# EAGLE design Rapide64a (EAGLE 6.3)
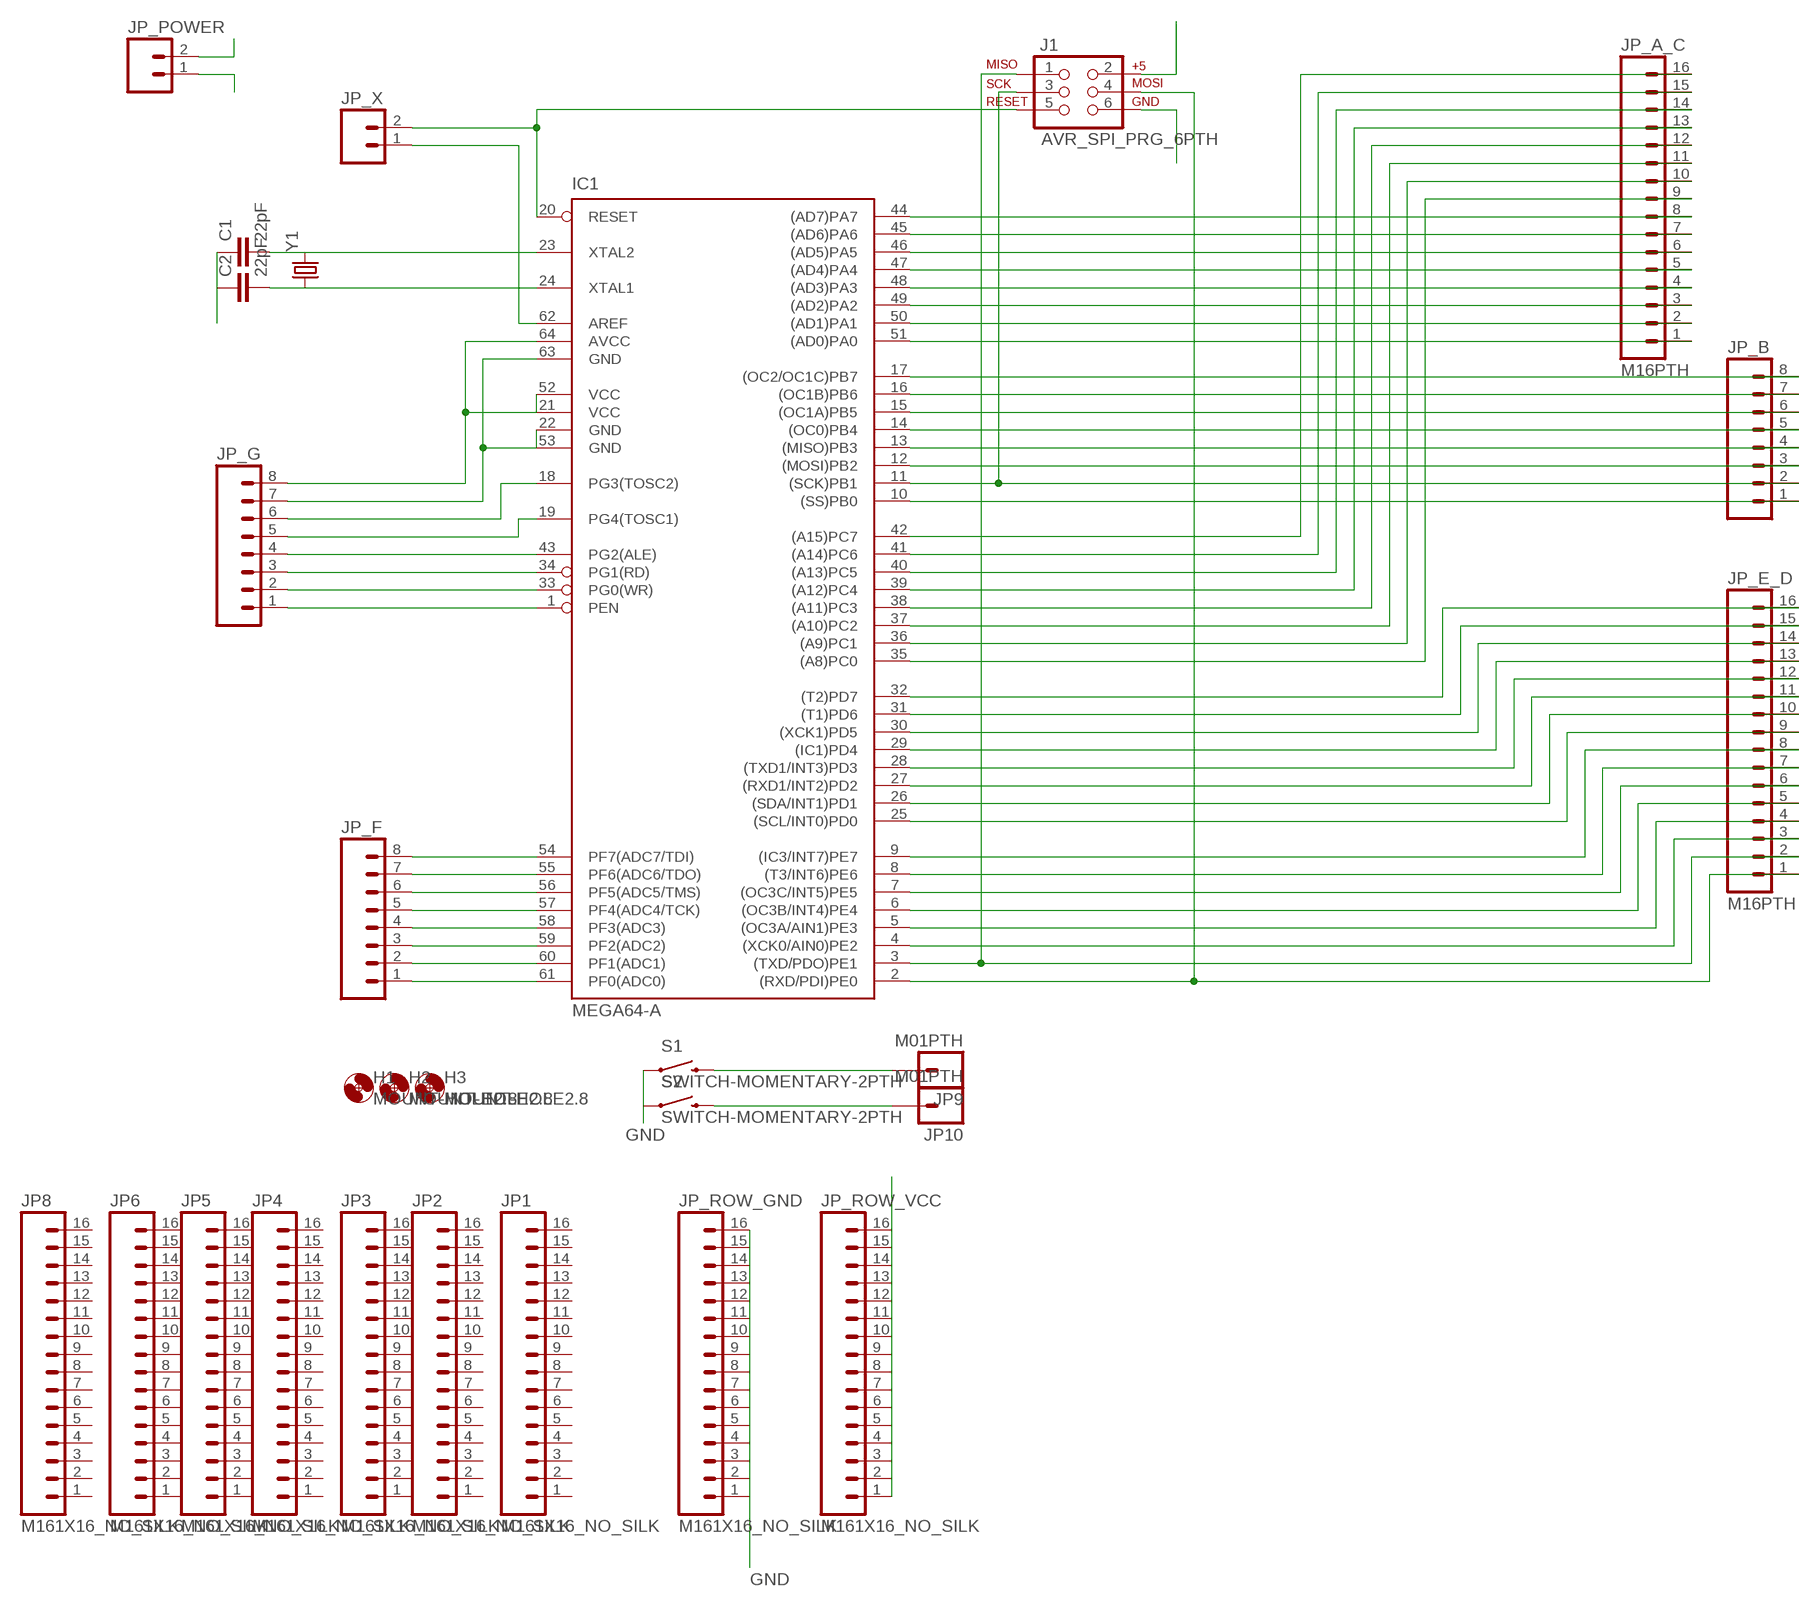
[diagram p0: schematic, sheet 1]

## Parts
C1  22pF  C-EU025-024X044  [C025-024X044]
C2  22pF  C-EU025-024X044  [C025-024X044]
H1  MOUNT-HOLE2.8  [2,8]
H2  MOUNT-HOLE2.8  [2,8]
H3  MOUNT-HOLE2.8  [2,8]
IC1  MEGA64-A  [TQFP64]
J1  AVR_SPI_PRG_6PTH  [2X3]
JP1  M161X16_NO_SILK  [1X16_NO_SILK]
JP2  M161X16_NO_SILK  [1X16_NO_SILK]
JP3  M161X16_NO_SILK  [1X16_NO_SILK]
JP4  M161X16_NO_SILK  [1X16_NO_SILK]
JP5  M161X16_NO_SILK  [1X16_NO_SILK]
JP6  M161X16_NO_SILK  [1X16_NO_SILK]
JP8  M161X16_NO_SILK  [1X16_NO_SILK]
JP9  M01PTH  [1X01]
JP10  M01PTH  [1X01]
JP_A_C  M16PTH  [1X16]
JP_B  M081X08  [1X08]
JP_E_D  M16PTH  [1X16]
JP_F  M081X08  [1X08]
JP_G  M081X08  [1X08]
JP_POWER  M02PTH  [1X02]
JP_ROW_GND  M161X16_NO_SILK  [1X16_NO_SILK]
JP_ROW_VCC  M161X16_NO_SILK  [1X16_NO_SILK]
JP_X  M02PTH  [1X02]
S1  SWITCH-MOMENTARY-2PTH  [TACTILE-PTH]
S2  SWITCH-MOMENTARY-2PTH  [TACTILE-PTH]
Y1  CRYSTALHC49UV  [HC49U-V]

## Nets
GND: C1.1 C2.1 IC1.22(GND) IC1.53(GND) IC1.63(GND) J1.6 JP_G.7 JP_POWER.1 JP_ROW_GND.1 JP_ROW_GND.2 JP_ROW_GND.3 JP_ROW_GND.4 JP_ROW_GND.5 JP_ROW_GND.6 JP_ROW_GND.7 JP_ROW_GND.8 JP_ROW_GND.9 JP_ROW_GND.10 JP_ROW_GND.11 JP_ROW_GND.12 JP_ROW_GND.13 JP_ROW_GND.14 JP_ROW_GND.15 JP_ROW_GND.16 S1.1 S2.1
MISO: IC1.3((TXD/PDO)PE1) J1.1 JP_E_D.2
MOSI: IC1.2((RXD/PDI)PE0) J1.4 JP_E_D.1
N$2: IC1.6((OC3B/INT4)PE4) JP_E_D.5
N$3: IC1.7((OC3C/INT5)PE5) JP_E_D.6
N$4: IC1.8((T3/INT6)PE6) JP_E_D.7
N$5: IC1.25((SCL/INT0)PD0) JP_E_D.9
N$6: IC1.9((IC3/INT7)PE7) JP_E_D.8
N$7: IC1.26((SDA/INT1)PD1) JP_E_D.10
N$8: IC1.27((RXD1/INT2)PD2) JP_E_D.11
N$9: IC1.58(PF3(ADC3)) JP_F.4
N$10: IC1.57(PF4(ADC4/TCK)) JP_F.5
N$11: IC1.56(PF5(ADC5/TMS)) JP_F.6
N$12: IC1.55(PF6(ADC6/TDO)) JP_F.7
N$13: IC1.54(PF7(ADC7/TDI)) JP_F.8
N$14: IC1.48((AD3)PA3) JP_A_C.4
N$16: IC1.10((SS)PB0) JP_B.1
N$17: IC1.49((AD2)PA2) JP_A_C.3
N$18: IC1.17((OC2/OC1C)PB7) JP_B.8
N$19: IC1.1(PEN) JP_G.1
N$20: IC1.33(PG0(WR)) JP_G.2
N$21: IC1.34(PG1(RD)) JP_G.3
N$22: IC1.18(PG3(TOSC2)) JP_G.6
N$23: IC1.19(PG4(TOSC1)) JP_G.5
N$24: IC1.39((A12)PC4) JP_A_C.13
N$35: IC1.12((MOSI)PB2) JP_B.3
N$36: IC1.13((MISO)PB3) JP_B.4
N$37: IC1.43(PG2(ALE)) JP_G.4
N$38: IC1.47((AD4)PA4) JP_A_C.5
N$39: IC1.46((AD5)PA5) JP_A_C.6
N$40: IC1.45((AD6)PA6) JP_A_C.7
N$41: JP9.1 S1.3
N$42: IC1.14((OC0)PB4) JP_B.5
N$43: IC1.51((AD0)PA0) JP_A_C.1
N$44: IC1.50((AD1)PA1) JP_A_C.2
N$45: IC1.15((OC1A)PB5) JP_B.6
N$46: JP10.1 S2.3
N$47: IC1.44((AD7)PA7) JP_A_C.8
N$48: IC1.16((OC1B)PB6) JP_B.7
N$49: IC1.42((A15)PC7) JP_A_C.16
N$50: IC1.41((A14)PC6) JP_A_C.15
N$51: IC1.40((A13)PC5) JP_A_C.14
N$56: IC1.35((A8)PC0) JP_A_C.9
N$58: IC1.62(AREF) JP_X.1
N$59: C1.2 IC1.23(XTAL2) Y1.2
N$60: C2.2 IC1.24(XTAL1) Y1.1
N$62: IC1.4((XCK0/AIN0)PE2) JP_E_D.3
N$63: IC1.5((OC3A/AIN1)PE3) JP_E_D.4
N$64: IC1.28((TXD1/INT3)PD3) JP_E_D.12
N$65: IC1.29((IC1)PD4) JP_E_D.13
N$66: IC1.30((XCK1)PD5) JP_E_D.14
N$67: IC1.31((T1)PD6) JP_E_D.15
N$68: IC1.32((T2)PD7) JP_E_D.16
N$69: IC1.38((A11)PC3) JP_A_C.12
N$70: IC1.61(PF0(ADC0)) JP_F.1
N$71: IC1.60(PF1(ADC1)) JP_F.2
N$72: IC1.59(PF2(ADC2)) JP_F.3
N$73: IC1.37((A10)PC2) JP_A_C.11
N$75: IC1.36((A9)PC1) JP_A_C.10
RESET: IC1.20(RESET) J1.5 JP_X.2
SCK: IC1.11((SCK)PB1) J1.3 JP_B.2
VCC: IC1.21(VCC) IC1.52(VCC) IC1.64(AVCC) J1.2 JP_G.8 JP_POWER.2 JP_ROW_VCC.1 JP_ROW_VCC.2 JP_ROW_VCC.3 JP_ROW_VCC.4 JP_ROW_VCC.5 JP_ROW_VCC.6 JP_ROW_VCC.7 JP_ROW_VCC.8 JP_ROW_VCC.9 JP_ROW_VCC.10 JP_ROW_VCC.11 JP_ROW_VCC.12 JP_ROW_VCC.13 JP_ROW_VCC.14 JP_ROW_VCC.15 JP_ROW_VCC.16
Unconnected: JP1.1 JP1.2 JP1.3 JP1.4 JP1.5 JP1.6 JP1.7 JP1.8 JP1.9 JP1.10 JP1.11 JP1.12 JP1.13 JP1.14 JP1.15 JP1.16 JP2.1 JP2.2 JP2.3 JP2.4 JP2.5 JP2.6 JP2.7 JP2.8 JP2.9 JP2.10 JP2.11 JP2.12 JP2.13 JP2.14 JP2.15 JP2.16 JP3.1 JP3.2 JP3.3 JP3.4 JP3.5 JP3.6 JP3.7 JP3.8 JP3.9 JP3.10 JP3.11 JP3.12 JP3.13 JP3.14 JP3.15 JP3.16 JP4.1 JP4.2 JP4.3 JP4.4 JP4.5 JP4.6 JP4.7 JP4.8 JP4.9 JP4.10 JP4.11 JP4.12 JP4.13 JP4.14 JP4.15 JP4.16 JP5.1 JP5.2 JP5.3 JP5.4 JP5.5 JP5.6 JP5.7 JP5.8 JP5.9 JP5.10 JP5.11 JP5.12 JP5.13 JP5.14 JP5.15 JP5.16 JP6.1 JP6.2 JP6.3 JP6.4 JP6.5 JP6.6 JP6.7 JP6.8 JP6.9 JP6.10 JP6.11 JP6.12 JP6.13 JP6.14 JP6.15 JP6.16 JP8.1 JP8.2 JP8.3 JP8.4 JP8.5 JP8.6 JP8.7 JP8.8 JP8.9 JP8.10 JP8.11 JP8.12 JP8.13 JP8.14 JP8.15 JP8.16

## Library data of the parts
C1 C2 = resistor:C-EU: CAPACITOR, European symbol
H1-H3 = holes:MOUNT-HOLE: MOUNTING HOLE with drill center marker
IC1 = atmel:MEGA64: MICROCONTROLLER 64 Kbytes FLASH 4 Kbytes SRAM 2 Kbytes EEPROM DUAL USART 8-channel 10 bit ADC Source: avr.lbr; MPN: ATMEGA64-16AU; OC_FARNELL: 9171355; OC_NEWARK: 01M6899
J1 = SparkFun-Connectors:AVR_SPI_PRG_6: AVR ISP 6 Pin This is the reduced ISP connector for AVR programming. Common on Arduino. This footprint will take up less PCB space and can be used with a 10-pin to 6-pin adapter such as SKU: BOB-08508
JP1-JP6 JP8 JP_A_C JP_E_D JP_ROW_GND JP_ROW_VCC = SparkFun-Connectors:M16: 1x16 .1" header
JP9 JP10 = SparkFun-Connectors:M01: Header 1 Standard 1-pin 0.1" header. Use with straight break away headers (SKU : PRT-00116), right angle break away headers (PRT-00553), swiss pins (PRT-00743), machine pins (PRT-00117), and female headers (PRT-00115).
JP_B JP_F JP_G = SparkFun-Connectors:M08: Header 8 Standard 8-pin 0.1" header. Use with straight break away headers (SKU : PRT-00116), right angle break away headers (PRT-00553), swiss pins (PRT-00743), machine pins (PRT-00117), and female headers (PRT-00115).
JP_POWER JP_X = SparkFun-Connectors:M02: Header 2 Standard 2-pin 0.1" header. Use with straight break away headers (SKU : PRT-00116), right angle break away headers (PRT-00553), swiss pins (PRT-00743), machine pins (PRT-00117), and female headers (PRT-00115). Molex polarized connector foot print use with SKU : PRT-08233 with associated crimp pins and housings.
S1 S2 = SparkFun-Electromechanical:SWITCH-MOMENTARY-2: Various NO switches- pushbuttons, reed, etc
Y1 = SparkFun-FreqCtrl:CRYSTAL: Various standard crystals. Proven footprints. Spark Fun Electronics SKU : COM-00534

## Board
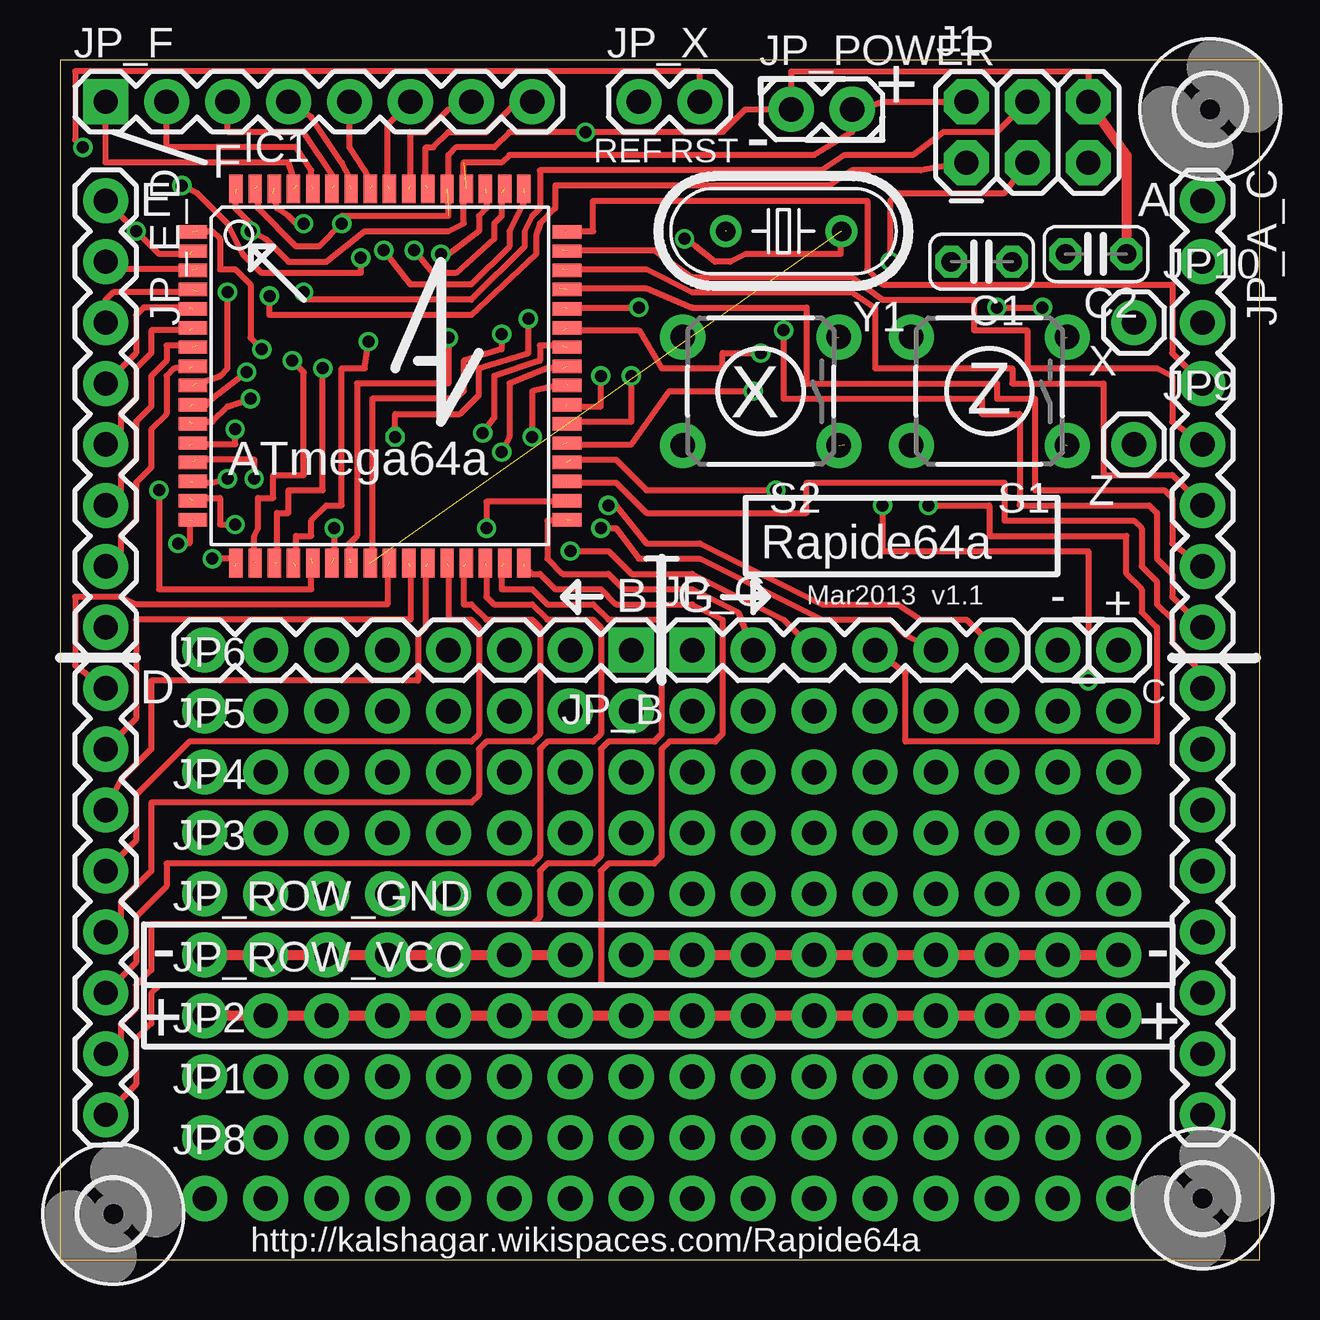
[diagram p1: board, top side]
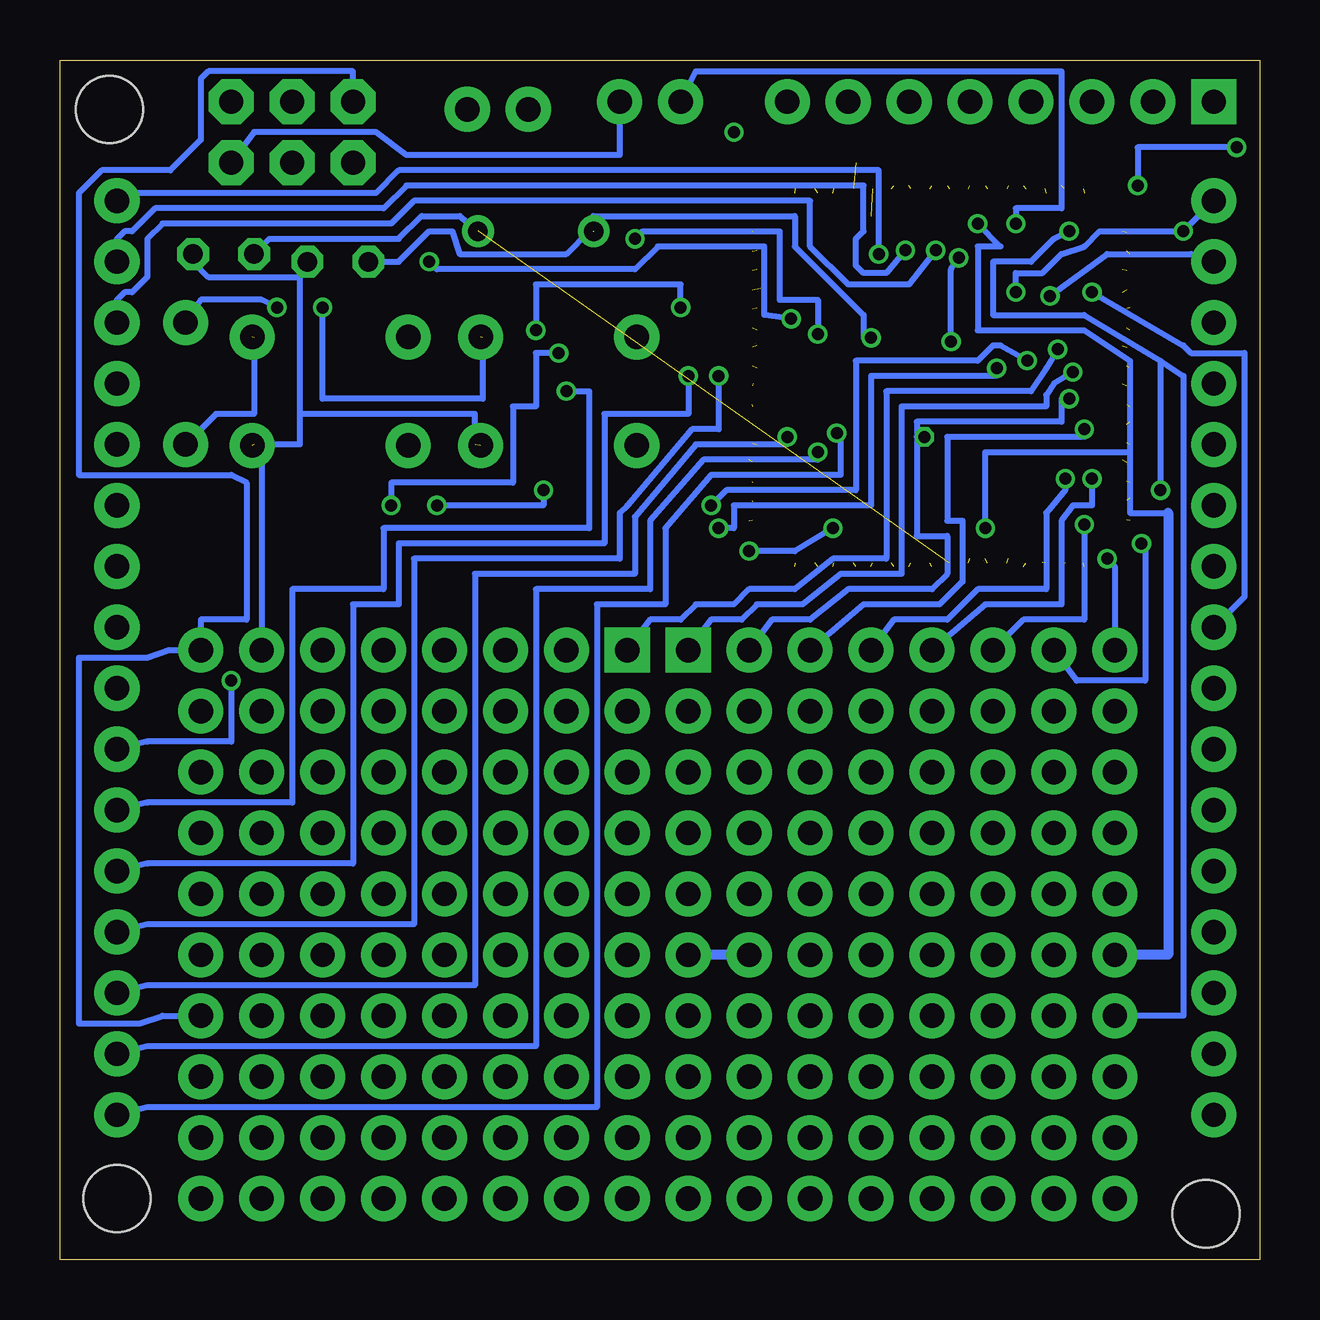
[diagram p2: board, bottom side, seen from below]

Size 50 x 50 mm. Coordinates in mm from the lower left corner, seen from the top.
Outline: 0,0 50,0 50,50 0,50 0,0
Copper layers (1*16): Top 0.035mm / dielectric 1.5mm / Bottom 0.035mm
Design rules "Fusion_eagle_rule_v1.1": minimum track width 6mil, minimum drill 12mil, track to track 6mil, track to pad 6mil, pad to pad 6mil, via to via 6mil, smd to smd 0mil, copper to edge 10mil, drill to drill 10mil, minimum pad ring 10mil, minimum via ring 6mil, stop-mask expansion 2mil, vias tented up to drill 100mil, thermal gap 10mil

### Footprints (pad centres in the part's own frame; a part is rotated, then mirrored left to right if it is on the bottom)
C025-024X044 = drill 0.813 octagon: 1 -1.27,0; 2 1.27,0
2,8 = hole 2.8: 0,0
TQFP64 = smd 1.194 x 0.559: 1 -7.8,6; 2 -7.8,5.2; 3 -7.8,4.4; 4 -7.8,3.6; 5 -7.8,2.8; 6 -7.8,2; 7 -7.8,1.2; 8 -7.8,0.4; 9 -7.8,-0.4; 10 -7.8,-1.2; 11 -7.8,-2; 12 -7.8,-2.8; 13 -7.8,-3.6; 14 -7.8,-4.4; 15 -7.8,-5.2; 16 -7.8,-6; 33 7.8,-6; 34 7.8,-5.2; 35 7.8,-4.4; 36 7.8,-3.6; 37 7.8,-2.8; 38 7.8,-2; 39 7.8,-1.2; 40 7.8,-0.4; 41 7.8,0.4; 42 7.8,1.2; 43 7.8,2; 44 7.8,2.8; 45 7.8,3.6; 46 7.8,4.4; 47 7.8,5.2; 48 7.8,6 | smd 0.559 x 1.194: 17 -6,-7.8; 18 -5.2,-7.8; 19 -4.4,-7.8; 20 -3.6,-7.8; 21 -2.8,-7.8; 22 -2,-7.8; 23 -1.2,-7.8; 24 -0.4,-7.8; 25 0.4,-7.8; 26 1.2,-7.8; 27 2,-7.8; 28 2.8,-7.8; 29 3.6,-7.8; 30 4.4,-7.8; 31 5.2,-7.8; 32 6,-7.8; 49 6,7.8; 50 5.2,7.8; 51 4.4,7.8; 52 3.6,7.8; 53 2.8,7.8; 54 2,7.8; 55 1.2,7.8; 56 0.4,7.8; 57 -0.4,7.8; 58 -1.2,7.8; 59 -2,7.8; 60 -2.8,7.8; 61 -3.6,7.8; 62 -4.4,7.8; 63 -5.2,7.8; 64 -6,7.8
2X3 = drill 1.016 pad 1.88 octagon: 1 0,0; 2 0,2.54; 3 2.54,0; 4 2.54,2.54; 5 5.08,0; 6 5.08,2.54
1X16_NO_SILK = drill 1.016 pad 1.88: 1 0,0; 2 2.54,0; 3 5.08,0; 4 7.62,0; 5 10.16,0; 6 12.7,0; 7 15.24,0; 8 17.78,0; 9 20.32,0; 10 22.86,0; 11 25.4,0; 12 27.94,0; 13 30.48,0; 14 33.02,0; 15 35.56,0; 16 38.1,0
1X01 = drill 1.016 pad 1.88: 1 0,0
1X16 = drill 1.016 pad 1.88: 1 0,0; 2 2.54,0; 3 5.08,0; 4 7.62,0; 5 10.16,0; 6 12.7,0; 7 15.24,0; 8 17.78,0; 9 20.32,0; 10 22.86,0; 11 25.4,0; 12 27.94,0; 13 30.48,0; 14 33.02,0; 15 35.56,0; 16 38.1,0
1X08 = drill 1.016 pad 1.88 square: 1 0,0 | drill 1.016 pad 1.88: 2 2.54,0; 3 5.08,0; 4 7.62,0; 5 10.16,0; 6 12.7,0; 7 15.24,0; 8 17.78,0
1X02 = drill 1.016 pad 1.88: 1 0,0; 2 2.54,0
TACTILE-PTH = drill 1.016 pad 1.88: 1 -3.251,2.261; 2 3.251,2.261; 3 -3.251,-2.261; 4 3.251,-2.261
HC49U-V = drill 0.813: 1 -2.413,0; 2 2.413,0

### Placement (x,y rotation side)
C1  38.42,41.59 180 top
C2  43.18,41.91 180 top
H1  2.22,1.91 0 top
H2  47.62,2.54 0 top
H3  47.94,47.94 0 top
IC1  13.34,36.83 0 top
J1  37.78,45.72 0 top
JP1  6.03,5.08 0 top
JP2  6.03,7.62 0 top
JP3  6.03,15.24 0 top
JP4  6.03,17.78 0 top
JP5  6.03,20.32 0 top
JP6  6.03,22.86 0 top
JP8  6.03,2.54 0 top
JP9  44.77,33.97 0 top
JP10  44.77,39.05 0 top
JP_A_C  47.62,44.13 270 top
JP_B  23.81,25.4 180 top
JP_E_D  1.91,44.13 270 top
JP_F  1.91,48.26 0 top
JP_G  26.35,25.4 0 top
JP_POWER  30.48,47.94 0 top
JP_ROW_GND  6.03,12.7 0 top
JP_ROW_VCC  6.03,10.16 0 top
JP_X  24.13,48.26 0 top
S1  38.73,36.2 180 top
S2  29.21,36.2 180 top
Y1  30.16,42.86 180 top

### Tracks (layer width: path | path; a pad name or v marks a point on that pad's centre or on a via)
GND  (via drill 0.5)  (5 unrouted)
  Top 0.254: J1.6 42.86,49.53 30.48,49.53 JP_POWER.1 28.57,47.94 27.62,46.99 v21.91,46.99 18.73,46.99 18.1,46.35 16.51,46.35 16.19,46.04 16.19,43.5 11.75,43.5 v11.75,43.18 10.79,42.23 9.84,42.23 8.26,43.81 8.26,44.77 | v11.43,30.48 11.43,29.21
  Top 0.406: JP_ROW_GND.1 JP_ROW_GND.2 JP_ROW_GND.3 JP_ROW_GND.4 JP_ROW_GND.5 JP_ROW_GND.6 JP_ROW_GND.7 | JP_ROW_GND.8 JP_ROW_GND.9 JP_ROW_GND.10 JP_ROW_GND.11 JP_ROW_GND.12 JP_ROW_GND.13 JP_ROW_GND.14 JP_ROW_GND.15 JP_ROW_GND.16 | J1.6 44.45,46.04 C2.1
  Bottom 0.254: C2.1 44.45,41.59 43.81,40.96 40.01,40.96 | C1.1 40.01,40.96 | 40.01,40.96 40.01,35.24 | 40.01,35.24 40.01,33.97 41.91,33.97 41.59,33.34 JP_G.7 | 32.7,33.97 32.7,35.24 40.01,35.24 | v11.75,43.18 10.79,42.23 11.75,42.23 11.75,38.73 7.3,38.73 5.4,37.47 5.4,33.66 | v11.43,30.48 11.43,33.66 5.4,33.66 | 5.4,33.66 5.4,31.11 3.81,31.11
  Bottom 0.406: JP_ROW_GND.7 JP_ROW_GND.8 | 3.81,31.11 3.81,12.7 JP_ROW_GND.1
MISO  (via drill 0.5)  (1 unrouted)
  Top 0.254: 5.71,41.27 2.22,41.27 JP_E_D.2 | J1.1 35.88,45.4 33.02,45.4 32.07,44.77 20.64,44.77 20.64,43.81 20,43.18 19.84,42.7 19.84,41.91 17.14,39.37 8.73,39.37 v8.73,40.16
  Bottom 0.254: v8.73,40.16 6.35,41.91 2.86,41.91 JP_E_D.2
MOSI  (via drill 0.5)  (1 unrouted)
  Top 0.254: 5.4,41.91 4.13,41.91 JP_E_D.1 | J1.4 39.05,46.99 36.83,46.99 35.56,46.04 32.7,46.04 31.75,45.4 20,45.4 20,43.81 19.68,43.5 19.37,42.86 19.37,42.23 17.14,40.01 10.16,40.01 v10.16,40.32
  Bottom 0.254: v10.16,40.32 10.16,41.12 9.05,41.12 8.26,41.91 7.3,42.23 6.67,42.86 v3.17,42.86 JP_E_D.1
N$2  (1 unrouted)
  Top 0.254: 5.4,38.73 3.81,38.73 3.81,37.78 3.17,37.15 3.17,35.88 2.54,35.24 2.54,34.61 JP_E_D.5
N$3  (1 unrouted)
  Top 0.254: 5.71,38.1 4.45,38.1 4.45,37.47 3.81,36.83 3.81,35.56 3.17,34.92 3.17,33.34 2.54,32.7 2.54,32.07 JP_E_D.6
N$4  (1 unrouted)
  Top 0.254: 5.4,37.15 4.76,37.15 4.45,36.83 4.45,35.24 3.81,34.61 3.81,33.02 3.17,32.38 3.17,30.8 2.54,30.16 2.54,29.53 JP_E_D.7
N$5  (1 unrouted)
  Top 0.254: 13.65,28.89 13.65,27.3 3.17,27.3 2.54,27.62 0.64,27.62 0.64,24.77 JP_E_D.9
N$6  (via drill 0.5)  (1 unrouted)
  Top 0.254: 5.71,36.51 6.67,36.83 6.99,37.15 v6.99,40.32
  Bottom 0.254: v6.99,40.32 3.17,38.1 2.86,37.78 0.64,37.78 0.64,27.62 JP_E_D.8
N$7  (1 unrouted)
  Top 0.254: 14.61,28.89 14.61,26.67 3.17,26.67 3.17,22.54 JP_E_D.10
N$8  (1 unrouted)
  Top 0.254: 15.24,28.89 15.24,26.35 14.92,26.04 14.92,24.13 3.81,24.13 3.81,21.27 2.54,20 JP_E_D.11
N$9  (1 unrouted)
  Top 0.254: 12.06,44.77 12.06,45.09 11.75,45.72 10.48,47.62 JP_F.4
N$10  (1 unrouted)
  Top 0.254: 13.02,44.77 12.7,45.4 12.06,46.35 JP_F.5
N$11  (1 unrouted)
  Top 0.254: 13.65,44.77 13.65,47.31 JP_F.6
N$12  (1 unrouted)
  Top 0.254: 14.61,44.77 14.61,46.99 15.24,46.99 16.19,47.94 JP_F.7
N$13  (1 unrouted)
  Top 0.254: 15.24,44.77 15.24,46.35 15.56,46.35 16.19,46.99 17.78,46.99 19.05,48.26 JP_F.8
N$14  (1 unrouted)
  Top 0.254: 21.11,42.86 22.23,42.86 22.23,44.13 33.66,44.13 33.66,41.27 34.29,40.64 46.35,40.64 46.35,37.78 JP_A_C.4
N$16  (via drill 0.5)  (1 unrouted)
  Top 0.254: 5.4,35.56 6.03,35.56 6.35,35.88 v7.78,36.99
  Bottom 0.254: v7.78,36.99 8.57,36.51 8.89,36.04 8.89,35.56 14.92,35.56 14.92,28.57 17.46,28.57 19.05,27.3 20.95,27.3 21.59,26.67 22.86,26.67 JP_B.1
N$17  (via drill 0.5)  (1 unrouted)
  Top 0.254: 19.37,44.45 19.37,44.13 18.73,42.86 18.73,42.23 17.14,40.64 14.61,40.64 v13.49,42.07
  Bottom 0.254: v13.49,42.07 14.61,40.64 17.14,40.64 18.73,42.23 18.73,44.13 35.24,44.13 36.2,43.18 45.72,43.18 46.35,42.55 46.35,40.96 46.99,40.32 47.31,40.32 47.62,40.01 JP_A_C.3
N$18  (via drill 0.5)  (1 unrouted)
  Top 0.254: 7.3,28.89 7.3,29.21 v6.35,29.21
  Bottom 0.254: v6.35,29.21 6.03,28.89 JP_B.8
N$19  (via drill 0.5)  (1 unrouted)
  Top 0.254: 5.71,42.86 6.35,42.86 6.67,42.55 6.67,41.27 7.3,41.27 7.94,40.64 7.94,38.42 v8.41,37.94
  Bottom 0.254: v8.41,37.94 8.89,37.15 9.53,36.2 15.56,36.2 15.56,29.21 17.78,29.21 19.37,27.94 21.27,27.94 21.91,27.3 23.5,27.3 24.13,26.67 25.4,26.67 JP_G.1
N$20  (1 unrouted)
  Top 0.254: 21.27,30.8 20.32,30.8 20.32,29.21 20.95,28.57 22.86,28.57 23.5,27.94 26.35,27.94 28.26,26.99 JP_G.2
N$21  (via drill 0.5)  (1 unrouted)
  Top 0.254: 21.11,31.59 17.78,31.59 v17.78,30.48 | v21.27,29.53 22.86,29.53 23.81,28.57 26.35,28.57 30.16,26.67 JP_G.3
  Bottom 0.254: v17.78,30.48 19.37,29.53 v21.27,29.53
N$22  (via drill 0.5)  (1 unrouted)
  Top 0.254: 8.1,29.05 8.1,30.16 8.26,30.48 8.26,31.75 8.89,31.75 8.89,32.7 10.16,32.7 10.16,36.99 v9.68,37.47 | v22.86,31.43 23.18,31.43 24.45,29.84 26.67,29.84 31.75,27.3 34.92,27.3 35.88,26.67 37.78,26.67 JP_G.6
  Bottom 0.254: v9.68,37.47 10.79,38.1 11.11,38.1 11.75,37.47 16.83,37.47 16.83,32.07 22.23,32.07 v22.86,31.43
N$23  (via drill 0.5)  (1 unrouted)
  Top 0.254: 9.05,29.05 9.05,31.11 9.53,31.11 9.53,32.07 10.95,32.07 v10.95,37.15 | v22.54,30.48 23.18,30.48 24.13,29.21 26.67,29.21 31.75,26.67 34.61,26.67 35.24,26.04 JP_G.5
  Bottom 0.254: v10.95,37.15 10.95,36.83 16.19,36.83 16.19,31.43 21.91,31.43 21.91,30.48 v22.54,30.48
N$24  (via drill 0.5)  (1 unrouted)
  Top 0.254: 20.95,35.72 21.11,35.56 22.54,35.56 v22.54,36.83
  Bottom 0.254: v22.54,36.83 22.54,34.61 23.65,34.61 26.35,31.43 26.67,31.11 26.67,29.21 35.24,29.21 35.24,13.97 46.35,13.97 JP_A_C.13
N$35  (via drill 0.5)  (1 unrouted)
  Top 0.254: 5.4,33.97 7.3,33.97 v7.3,34.61
  Bottom 0.254: v7.3,34.61 7.3,34.29 13.02,34.29 13.02,30.8 12.38,30.8 12.38,28.26 13.34,27.3 16.51,27.3 JP_B.3
N$36  (via drill 0.5)  (1 unrouted)
  Top 0.254: 5.71,33.34 8.1,33.34 v8.1,32.54
  Bottom 0.254: v8.1,32.54 8.1,32.07 8.89,31.11 8.89,27.94 11.75,27.94 13.02,26.67 15.24,26.67 JP_B.4
N$37  (via drill 0.5)  (1 unrouted)
  Top 0.254: 20.95,38.73 24.13,38.73 25.08,37.15 27.62,37.15 27.62,37.78 v29.21,37.78 | v36.2,31.43 38.73,31.43 38.73,30.16 44.45,30.16 44.45,28.57 45.09,27.94 45.09,26.99 45.72,26.35 45.72,21.59 35.24,21.59 35.24,24.45 JP_G.4
  Bottom 0.254: v29.21,37.78 30.16,37.78 30.16,35.56 31.11,35.56 31.11,32.38 36.2,32.38 v36.2,31.43
N$38  (1 unrouted)
  Top 0.254: 20.95,42.07 24.77,42.07 26.35,40.96 33.02,40.96 34.29,40.01 38.1,40.01 38.1,38.73 40.32,38.73 40.32,37.15 45.72,37.15 46.35,36.83 46.35,34.92 JP_A_C.5
N$39  (1 unrouted)
  Top 0.254: 20.95,41.27 24.45,41.27 26.35,40.32 33.02,40.32 33.97,39.69 33.97,37.15 39.69,37.15 39.69,36.51 43.5,36.51 43.5,32.7 46.35,32.7 JP_A_C.6
N$40  (1 unrouted)
  Top 0.254: 20.8,40.48 24.45,40.48 26.35,39.69 31.11,39.69 31.11,36.51 39.05,36.51 39.05,35.88 40.64,35.88 40.64,32.07 46.04,32.07 46.35,31.75 46.35,29.84 JP_A_C.7
N$41  (1 unrouted)
  Bottom 0.254: 41.91,38.42 41.91,35.24 43.5,35.24 JP9.1
N$42  (via drill 0.5)  (1 unrouted)
  Top 0.254: 5.4,32.38 6.35,32.38 v6.99,32.54
  Bottom 0.254: v6.99,32.54 6.99,31.43 7.78,31.43 8.26,30.8 8.26,27.3 11.43,27.3 JP_B.5
N$43  (via drill 0.5)  (1 unrouted)
  Top 0.254: 17.78,44.45 17.78,43.81 17.46,43.5 17.46,42.86 16.19,41.91 v15.88,41.91
  Bottom 0.254: v15.88,41.91 15.88,45.4 35.88,45.4 36.83,44.45 47.31,44.45 JP_A_C.1
N$44  (via drill 0.5)  (1 unrouted)
  Top 0.254: 18.41,44.45 18.41,43.5 18.1,43.18 18.1,42.55 16.51,41.12 15.56,41.12 v14.76,42.07
  Bottom 0.254: v14.76,42.07 15.56,41.12 16.51,41.12 16.83,41.43 16.83,42.55 16.51,42.86 16.51,44.77 35.56,44.77 36.51,43.81 46.04,43.81 46.99,42.86 47.31,42.86 47.62,42.55 JP_A_C.2
N$45  (via drill 0.5)  (1 unrouted)
  Top 0.254: 5.4,31.75 6.67,31.75 6.67,30.64 v7.3,30.64
  Bottom 0.254: v7.3,30.64 7.3,26.67 9.84,26.67 JP_B.6
N$46  (via drill 0.5)  (1 unrouted)
  Top 0.254: v39.05,39.69 v40.96,39.69
  Bottom 0.254: 32.38,38.42 32.38,35.88 39.05,35.88 v39.05,39.69 | v40.96,39.69 41.59,40.01 44.13,40.01 JP10.1
N$47  (via drill 0.5)  (1 unrouted)
  Top 0.254: 20.95,39.69 v24.13,39.69 | v30.16,38.73 30.16,35.88 38.42,35.88 38.42,35.24 40.01,35.24 40.01,31.43 45.4,31.43 45.72,31.11 45.72,29.21 46.35,28.57 46.35,27.62 JP_A_C.8
  Bottom 0.254: v24.13,39.69 24.13,40.64 30.16,40.64 v30.16,38.73
N$48  (via drill 0.5)  (1 unrouted)
  Top 0.254: 5.4,30.8 5.4,29.84 v4.92,29.84
  Bottom 0.254: v4.92,29.84 4.76,29.53 4.76,24.13 7.62,24.13 JP_B.7
N$49  (via drill 0.5)  (1 unrouted)
  Top 0.254: 20.95,38.1 20,38.1 20,37.47 18.1,36.83 18.1,35.08 v17.62,34.45
  Bottom 0.254: v17.62,34.45 17.46,34.29 17.46,32.7 22.86,32.7 24.77,30.48 24.77,27.3 27.62,27.3 27.62,6.35 46.35,6.35 JP_A_C.16
N$50  (via drill 0.5)  (1 unrouted)
  Top 0.254: 20.95,37.15 20.32,37.15 18.73,36.51 18.73,34.29 v18.41,33.66
  Bottom 0.254: v18.41,33.66 18.41,33.34 23.18,33.34 25.4,30.8 25.4,27.94 30.16,27.94 30.16,8.89 46.35,8.89 JP_A_C.15
N$51  (via drill 0.5)  (1 unrouted)
  Top 0.254: 21.11,36.51 19.68,36.2 v19.68,34.29
  Bottom 0.254: v19.68,34.29 19.68,33.97 23.5,33.97 26.04,30.96 26.04,28.57 32.7,28.57 32.7,11.43 46.35,11.43 JP_A_C.14
N$56  (1 unrouted)
  Top 0.254: JP_A_C.9 47.31,24.77 46.35,25.72 46.35,26.67 45.72,27.3 45.72,28.26 45.09,28.89 45.09,30.48 44.77,30.8 39.37,30.8 39.37,32.38 31.11,32.38 31.11,31.11 24.45,31.11 23.18,32.38 21.11,32.38
N$58  (via drill 0.5)  (1 unrouted)
  Top 0.254: v10.16,43.18 9.84,43.18 9.53,43.5 9.05,43.81 8.89,44.45
  Bottom 0.254: JP_X.1 23.5,49.53 8.26,49.53 8.26,43.81 10.16,43.81 v10.16,43.18
N$59  (via drill 0.5)  (2 unrouted)
  Top 0.254: v16.19,38.42 16.19,36.51 12.38,36.51 12.38,30.16 12.06,29.84 12.06,29.21
  Bottom 0.254: C1.2 35.88,41.59 34.61,42.86 33.66,42.86 33.34,41.91 28.89,41.91 27.94,42.86 27.78,42.86 27.78,43.5 19.37,43.5 19.37,42.23 16.51,39.37 16.51,38.42 v16.19,38.42
N$60  (2 unrouted)
  Bottom 0.254: C2.2 41.27,42.55 35.88,42.55 34.92,43.5 33.34,43.5 32.54,42.86
N$62  (1 unrouted)
  Top 0.254: 5.71,40.32 2.22,40.32 1.91,40.01 JP_E_D.3
N$63  (1 unrouted)
  Top 0.254: 5.4,39.69 3.49,39.69 3.17,39.37 3.17,37.78 JP_E_D.4
N$64  (1 unrouted)
  Top 0.254: 16.19,28.89 16.19,26.67 17.14,26.67 17.46,26.35 17.46,21.91 17.14,21.59 5.4,21.59 3.17,19.37 3.17,17.46 JP_E_D.12
N$65  (1 unrouted)
  Top 0.254: 16.83,28.89 16.83,27.3 17.14,27.3 17.78,26.67 19.68,26.67 20,26.35 20,21.91 19.68,21.59 17.78,21.59 17.46,21.27 17.46,19.37 17.14,19.05 3.81,19.05 3.81,16.19 2.54,14.92 2.54,14.29 JP_E_D.13
N$66  (1 unrouted)
  Top 0.254: 17.78,28.89 17.78,27.62 18.1,27.3 19.68,27.3 20.32,26.67 22.23,26.67 22.54,26.35 22.54,21.91 22.23,21.59 20.32,21.59 20,21.27 20,16.83 19.68,16.51 4.45,16.51 4.45,15.56 3.17,14.29 3.17,12.38 JP_E_D.14
N$67  (1 unrouted)
  Top 0.254: 18.41,28.89 18.41,27.94 19.68,27.94 20.32,27.3 22.23,27.3 22.86,26.67 25.08,26.67 25.08,21.91 24.77,21.59 22.86,21.59 22.54,21.27 22.54,16.83 22.23,16.51 20.32,16.51 20,16.19 20,14.29 19.68,13.97 3.81,13.97 3.81,12.06 3.17,11.43 3.17,10.48 2.54,9.84 2.54,9.21 JP_E_D.15
N$68  (1 unrouted)
  Top 0.254: 19.37,28.89 19.68,28.57 20,28.57 20.64,27.94 22.54,27.94 23.18,27.3 26.35,27.3 27.62,26.67 27.62,21.91 27.3,21.59 25.4,21.59 25.08,21.27 25.08,16.83 24.77,16.51 22.86,16.51 22.54,16.19 22.54,11.43 4.13,11.43 3.81,11.11 3.81,9.84 3.17,9.21 3.17,7.3 JP_E_D.16
N$69  (via drill 0.5)  (1 unrouted)
  Top 0.254: 21.27,34.92 23.81,34.92 v23.81,36.83
  Bottom 0.254: v23.81,36.83 23.81,35.24 27.3,35.24 27.3,29.84 35.88,29.84 35.88,27.3 37.78,27.3 37.78,16.51 46.35,16.51 JP_A_C.12
N$70  (1 unrouted)
  Top 0.254: 9.84,44.77 9.53,45.72 1.91,45.72 JP_F.1
N$71  (1 unrouted)
  Top 0.254: 10.48,44.77 10.48,45.4 9.84,46.35 4.45,46.35 JP_F.2
N$72  (1 unrouted)
  Top 0.254: 11.43,44.77 11.43,45.09 10.16,46.99 6.99,46.99 JP_F.3
N$73  (via drill 0.5)  (1 unrouted)
  Top 0.254: 20.95,33.97 23.81,33.97 25.4,36.2 v28.89,36.2
  Bottom 0.254: v28.89,36.2 27.94,36.2 27.94,30.48 36.51,30.48 36.51,27.94 40.32,27.94 40.32,19.05 46.35,19.05 JP_A_C.11
N$75  (via drill 0.5)  (1 unrouted)
  Top 0.254: 21.27,33.34 23.18,33.34 24.45,32.07 v29.84,32.07 | v34.29,31.43 34.29,29.53 42.86,29.53 v42.86,24.13
  Bottom 0.254: v29.84,32.07 29.84,31.43 v34.29,31.43 | v42.86,24.13 42.86,21.59 46.35,21.59 JP_A_C.10
N$80  (via drill 0.5)
  Top 0.254: v26.04,42.55 26.51,42.23 27.3,41.59 27.94,41.59 28.57,41.91 32.54,41.91 32.54,42.86 | v18.41,38.58 18.41,37.94 16.83,37.47 16.83,36.2 16.51,35.88 13.02,35.88 13.02,28.89
  Bottom 0.254: v26.04,42.55 25.72,42.86 20,42.86 20,40.01 18.41,40.01 v18.41,38.58
RESET  (via drill 0.5)  (1 unrouted)
  Top 0.254: JP_X.2 26.67,49.53 0.64,49.53 0.64,46.67 v0.95,46.35 | 9.84,28.89 9.84,30.16 10.48,30.16 10.48,30.8 11.11,31.43 11.75,31.43 11.75,37.15 12.7,37.15 v12.86,38.26 | v12.54,41.75 12.54,41.12 8.41,41.12 7.62,41.91 6.99,43.18 5.71,44.45 v5.08,44.77
  Bottom 0.254: JP_X.2 26.67,46.04 35.56,46.04 36.83,46.99 41.91,46.99 J1.5 | v0.95,46.35 5.08,46.35 v5.08,44.77 | v12.86,38.26 12.86,41.27 v12.54,41.75
SCK  (via drill 0.5)  (1 unrouted)
  Top 0.254: 5.4,34.92 6.35,34.92 6.99,35.56 v7.94,35.88 | v13.97,34.29 13.97,35.24 16.67,35.24 17.46,36.04 17.46,37.15 19.53,37.78 v19.53,39.21 | v34.61,41.59 34.61,44.13 34.92,44.45 39.37,44.45 J1.3
  Bottom 0.254: v7.94,35.88 8.26,35.88 8.26,34.92 14.29,34.92 14.29,34.29 | 14.29,34.29 14.29,30.16 13.02,30.16 13.02,28.57 13.65,27.94 17.14,27.94 18.73,26.67 20.32,26.67 JP_B.2 | 14.29,34.29 v13.97,34.29 | v19.53,39.21 20.64,39.37 20.64,42.23 25.08,42.23 26.04,41.27 34.29,41.27 v34.61,41.59
VCC  (via drill 0.5)  (3 unrouted)
  Top 0.254: J1.2 34.29,48.26 33.34,47.94 JP_POWER.2 33.02,46.99 31.43,46.04 18.73,46.04 18.41,45.72 16.83,45.72 16.83,43.18 16.19,42.86 12.7,42.86 11.11,41.59 9.53,41.59 8.57,42.55 v7.94,42.86 7.94,43.18 7.3,43.81 7.3,44.45 | v4.13,32.07 4.13,27.94 10.48,27.94 10.48,29.21
  Top 0.406: JP_ROW_VCC.16 JP_ROW_VCC.15 JP_ROW_VCC.14 JP_ROW_VCC.13 JP_ROW_VCC.12 JP_ROW_VCC.11 JP_ROW_VCC.10 JP_ROW_VCC.9 JP_ROW_VCC.8 JP_ROW_VCC.7 JP_ROW_VCC.6 JP_ROW_VCC.5 JP_ROW_VCC.4 JP_ROW_VCC.3 JP_ROW_VCC.2 JP_ROW_VCC.1
  Bottom 0.254: 4.13,37.47 v4.13,32.07 | v7.94,42.86 8.57,42.55 9.53,41.59 11.11,41.59 11.11,39.37 7.3,39.37 4.13,37.47 | 4.13,37.47 3.17,36.83 3.17,10.16 JP_ROW_VCC.1 | J1.2 37.78,49.53 43.81,49.53 44.13,49.21 44.13,46.67 45.4,45.4 48.26,45.4 49.21,44.45 49.21,32.7 42.86,32.7 42.23,32.38 42.23,26.67 44.13,26.67 JP_G.8 45.4,25.4 46.35,25.08 49.21,25.08 49.21,9.84 46.67,9.84 45.72,10.16 JP_ROW_VCC.16

### Text on the board
_tNames: + | REF | RST | - | F | E | A | X | X | Z | ATmega64a | Z | Rapide64a | B | G | Mar2013 v1.1 | - | + | D | C | - | - | + | + | http://kalshagar.wikispaces.com/Rapide64a